# Altium schematic sheet Joystick.SchDoc: JOYSTICK
size 431 x 279 mm; Date: 02/07/2022; ApprovedBy: RTZ,HYW; CheckedBy: RTZ,HYW; Author: RTZ,HYW; CompanyName: Upenn; DrawnBy: RTZ,HYW; Engineer: RTZ,HYW; Organization: Upenn ESE; Address1: Electrical Engineering; Address2: 200 South 33rd St; Address3: Philadelphia; Address4: PA, 19104; SheetNumber: 7; SheetTotal: 11; ENG_APP_DATE: 02/15/22; DSN_APP_DATE: 02/15/22; CHK_APP_DATE: 02/15/22; DOC_NO_ASSY_DWG: TBD; DOC_NO_FAB_DWG: TBD; PCB_DWG_NO: TBD; Project: SimonSayGame; DESIGN_ITEM: 1.0; CAGE_CODE: TBD; DOC_NO_SCH_DWG: TBD; SCH_SCALE: NA; Time: 13:18
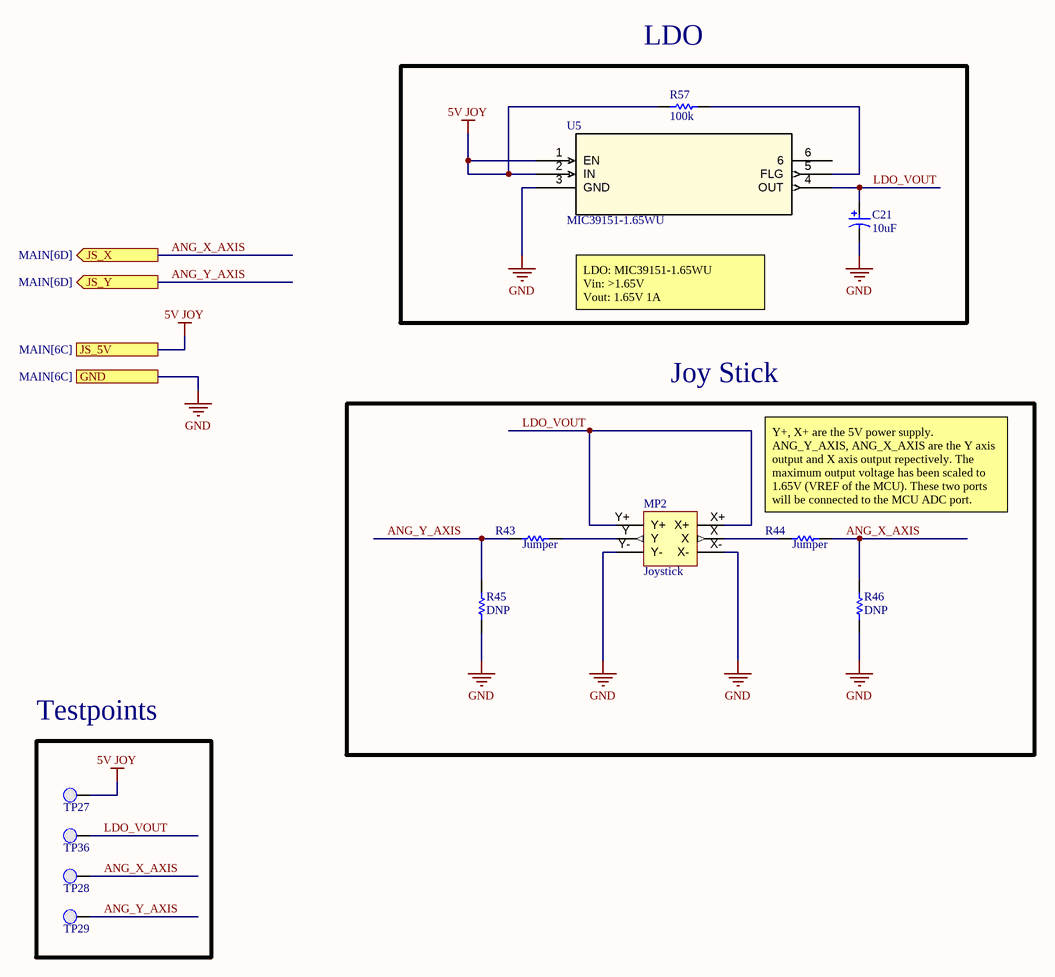
[diagram p0: Joystick.SchDoc]

## Parts
C21  10uF  [TMCHC1C106MTRF]
MP2  Joystick  [Joystick]
R43  Jumper  [RESC0603(1608)_N]
R44  Jumper  [RESC0603(1608)_N]
R45  DNP  [DNP]  (no BOM)
R46  DNP  [DNP]  (no BOM)
R57  100k  [RESC1609X55X30ML10T20]
TP27  0.1" Pad  [PCBComponent]  (value not drawn)  (no BOM)
TP28  0.1" Pad  [PCBComponent]  (value not drawn)  (no BOM)
TP29  0.1" Pad  [PCBComponent]  (value not drawn)  (no BOM)
TP36  0.1" Pad  [PCBComponent]  (value not drawn)  (no BOM)
U5  MIC39151-1.65WU  [TO-263-5_MCL]

## Blocks framed on the sheet
LDO: C21 R57 U5
Joy Stick: MP2 R43-R46
Testpoints: TP27-TP29 TP36

## Ports
GND (see MAIN[6C]), JS_5V (see MAIN[6C]), JS_X (out, see MAIN[6D]), JS_Y (out, see MAIN[6D])

## Nets
5V JOY: R57.1 TP27.1(PAD) U5.1(EN) U5.2(IN) ; port JS_5V
GND: C21.2 MP2.X- MP2.Y- R45.1 R46.1 U5.3(GND) ; port GND
ANG_X_AXIS: R44.2 R46.2 TP28.1(PAD) ; port JS_X
ANG_Y_AXIS: R43.1 R45.2 TP29.1(PAD) ; port JS_Y
LDO_VOUT: C21.1 MP2.X+ MP2.Y+ TP36.1(PAD) U5.4(OUT)
NetMP2_X: MP2.X R44.1
NetMP2_Y: MP2.Y R43.2
NetR57_2: R57.2 U5.5(FLG)

Not connected (* = marked no-connect by the designer): U5 6

## Notes on the sheet
- LDO: MIC39151-1.65WU
  Vin: >1.65V
  Vout: 1.65V 1A
- (near R44) Y+, X+ are the 5V power supply.
  ANG_Y_AXIS, ANG_X_AXIS are the Y axis output and X axis output repectively. The maximum output voltage has been scaled to 1.65V (VREF of the MCU). These two ports will be connected to the MCU ADC port.
  Y-, X- are the GND.
- DWG. NO.
- REV.
- SHT.
- THIS DOCUMENT AND THE DATA DISCLOSED HEREIN OR HEREWITH IS THE PROPERTY OF ALTIUM LIMITED AND MAY BE FREELY DISTRIBUTED IN WHOLE. NO RIGHTS ARE RESERVED OR EXPRESS OR IMPLIED WARANTEE GIVEN.
- REVISION
- DESCRIPTION
- DATE
- APPROVED
- ENG:
- APPROVALS
- PROJECT
- DSN:
- CHK:
- REFERENCE DOCUMENTS
- PROJECT REVISION:
- TITLE
- DOCUMENT REVISION:
- DESIGN ITEM:
- BOM:
- FAB DWG:
- PCB DWG:
- ASSY DWG:
- SCALE:
- SIZE
- B
- CAGE CODE
- FILE NAME
- DWG NO.
- SHEET
- OF
- REV

## Library data of the parts
C21 = TMCHC1C106MTRF: 10uF TMCHC1C106MTRF LDO capacitor; Manufacturer Part Number: TMCHC1C106MTRF; Category: Tantalum Capacitors; RoHS Compliant: Yes
R43 R44 = CMP-1012-00001-1: Jumper 0603 (1608 Metric); Case-Metric: 1608; Value: 0.00 Ohm; Power: None; Case-EIA: 0603; Technology: SMT; Tolerance: None
R45 R46 = DNP: Temperature Coefficient: 100ppm/°C; Power Rating: 63mW; Voltage Rating: 50V; Resistance Tolerance: 1%; RoHS: Yes; Case/Package: 0402; Number of Pins: 2; Contact Plating: Tin; Case Code (Metric): 1005; Case Code (Imperial): 0402; Min Operating Temperature: -55°C; Max Operating Temperature: 155°C; Resistor Type: Thick Film; Package Quantity: 10; Number of Terminations: 2; Termination: SMD/SMT; Max Power Dissipation: 63mW; Features: Automotive AEC-Q200; Series: CRCW; Voltage Rating (DC): 50V; Construction: Rectangular; Technology: THICK FILM; Length: 1mm; Width: 0.02inch; Height: 0.35mm; Depth: 0.5mm; Radiation Hardening: No; RoHS Compliant: Yes; Lead Free: Lead Free; REACH SVHC: Unknown; Military Standard: Not
R57 = CMP-2000-03685-1: Manufacturer: Vishay Dale; Part Number: TNPW0603100KBEEA
TP27-TP29 TP36 = 0.1" Pad-A.4
U5 = MIC39151-1.65WU: No Description Available; Mfr_Name: Micrel; Copyright: Copyright (C) 2022 Ultra Librarian. All rights reserved.; Manufacturer_Part_Number: MIC39151-1.65WU; Digi-Key_Part_Number_1: MIC39151-1.65WU-ND; RefDes: RefDes; Type: DEV